# EAGLE design sm_watch (EAGLE 9.6.2)
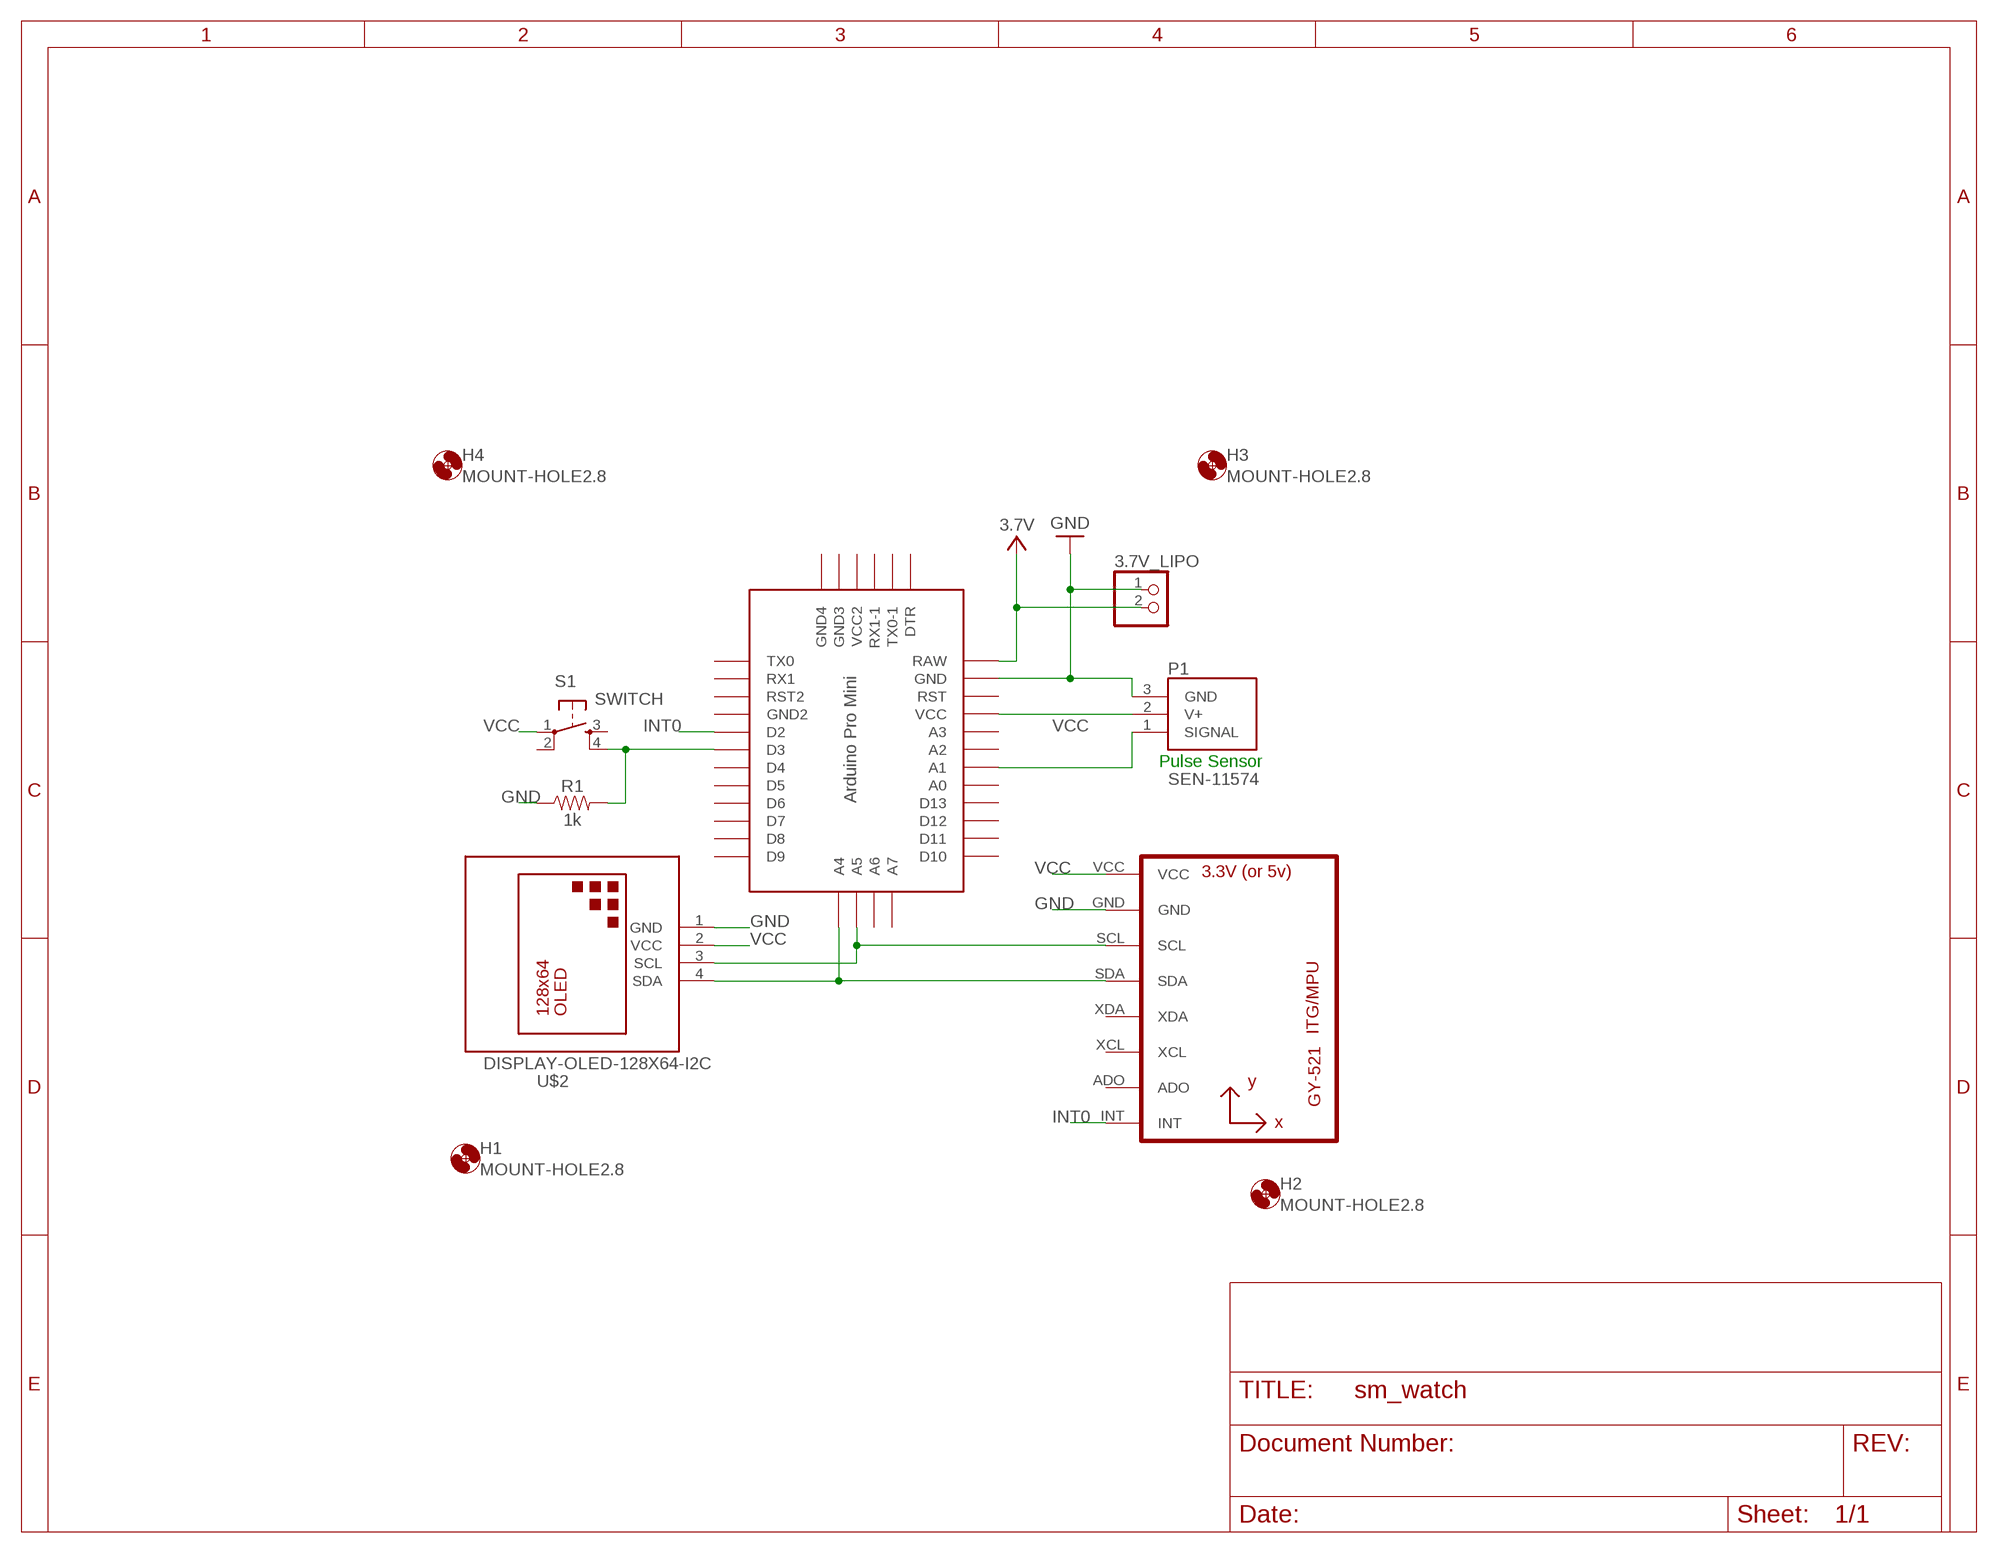
[diagram p0: schematic, sheet 1]

## Parts
3.7V_LIPO  PINHD-1X2/90  [1X02/90]
H1  MOUNT-HOLE2.8  [2,8]
H2  MOUNT-HOLE2.8  [2,8]
H3  MOUNT-HOLE2.8  [2,8]
H4  MOUNT-HOLE2.8  [2,8]
P1  SEN-11574  [XDCR_SEN-11574]
R1  1k  1KOHM-0402T-1/16W-1%  [0402-TIGHT]
S1  SWITCH  DTS-6  [DTS-6]
U1  GY-521MPU6050  [GY-521]
U$1  PRO-MINI  [PRO-MINI]
U$2  DISPLAY-OLED-128X64-I2C  [DISPLAY-OLED-128X64-I2C]

## Nets
+3V3: 3.7V_LIPO.2 U$1.RAW ; supply symbol labelled 3.7V
GND: 3.7V_LIPO.1 P1.3(GND) R1.1 U1.GND U$1.GND U$2.1(GND)
INT0: U1.INT U$1.D2
INT1: R1.2 S1.4 U$1.D3
N$1: U1.SDA U$1.A4 U$2.4(SDA)
N$2: U1.SCL U$1.A5 U$2.3(SCL)
N$4: P1.1(SIGNAL) U$1.A1
VCC: P1.2(V+) S1.1 U1.VCC U$1.VCC U$2.2(VCC)
Unconnected: S1.2 S1.3 U1.ADO U1.XCL U1.XDA U$1.A0 U$1.A2 U$1.A3 U$1.A6 U$1.A7 U$1.D4 U$1.D5 U$1.D6 U$1.D7 U$1.D8 U$1.D9 U$1.D10 U$1.D11 U$1.D12 U$1.D13 U$1.DTR U$1.GND1(GND2) U$1.GND2(GND4) U$1.GND3 U$1.RST U$1.RST1(RST2) U$1.RX1 U$1.RX1-1 U$1.TX0 U$1.TX0-1 U$1.VCC1(VCC2)

## Notes on the sheet
- Pulse Sensor

## Library data of the parts
3.7V_LIPO = pinhead:PINHD-1X2: PIN HEADER
H1-H4 = holes:MOUNT-HOLE: MOUNTING HOLE with drill center marker
P1 = SEN-11574:SEN-11574: Pulse Sensor For Arduino Buy Part <https://snapeda.com/parts/SEN-11574/SparkFun/view-part/?ref=eda>; AVAILABILITY: Bad; DESCRIPTION: PULSE SENSOR FOR ARDUINO; DIGIKEY-PURCHASE-URL: https://snapeda.com/shop?store=DigiKey&id=1269548; MF: SparkFun; MOUSER-PURCHASE-URL: https://snapeda.com/shop?store=Mouser&id=1269548; MP: SEN-11574; PACKAGE: None; PRICE: None
R1 = SparkFun-Resistors:1KOHM: 1kΩ resistor A resistor is a passive two-terminal electrical component that implements electrical resistance as a circuit element. Resistors act to reduce current flow, and, at the same time, act to lower voltage levels within circuits. - Wikipedia; PROD_ID: RES-14342
S1 = switch-tact:DTS-6
U1 = gy-521:GY-521
U$1 = Arduino-clone:PRO-MINI: Arduion Pro Mini Clone V1.0 www.betemcu.cu
U$2 = diy-modules:DISPLAY-OLED-128X64-I2C: 128x64 Dot Matrix OLED Module based on SSD1306 chip Variant with I2C interface More details available here: http://www.instructables.com/id/Monochrome-096-i2c-OLED-display-with-arduino-SSD13/ SSD1306 datasheet: https://cdn-shop.adafruit.com/datasheets/SSD1306.pdf Click here to find device on ebay.com <http://www.ebay.com/sch/oled+display+128x64+iic> Note: There are two variants: I2C and SPI. Search for the proper version.

## Board
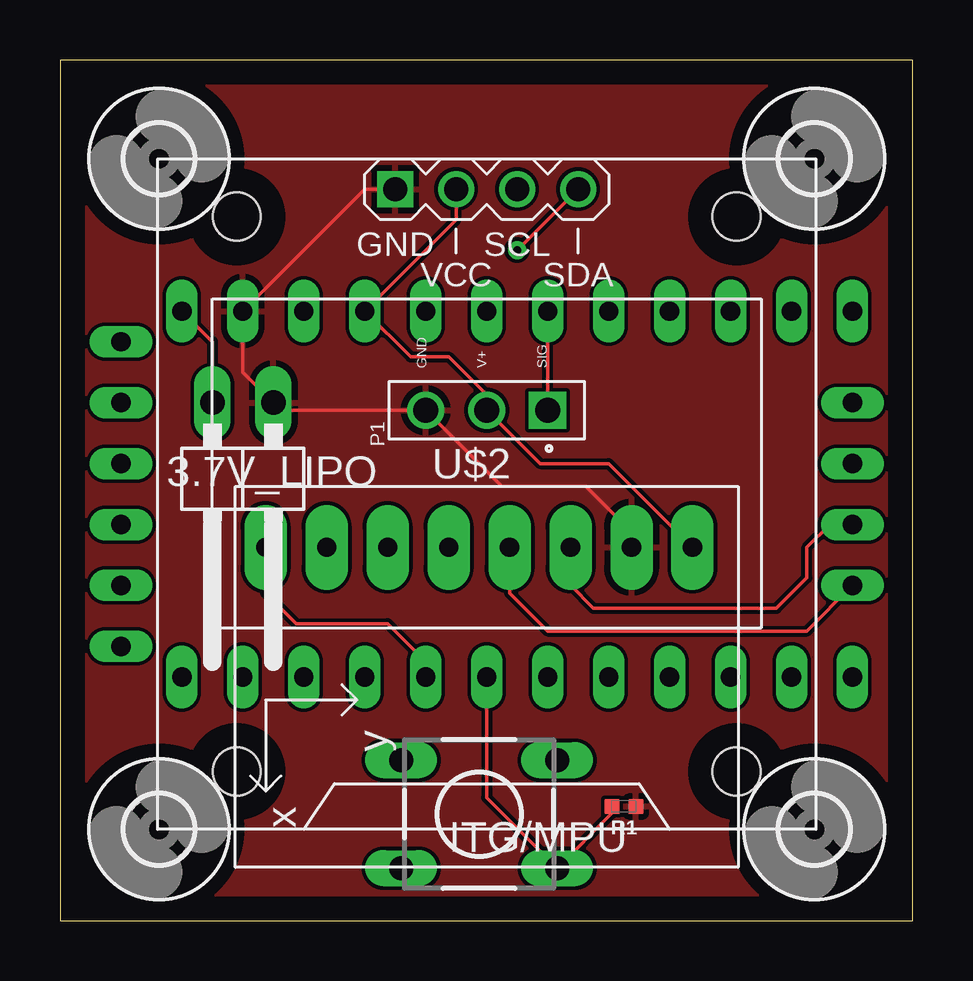
[diagram p1: board, top side]
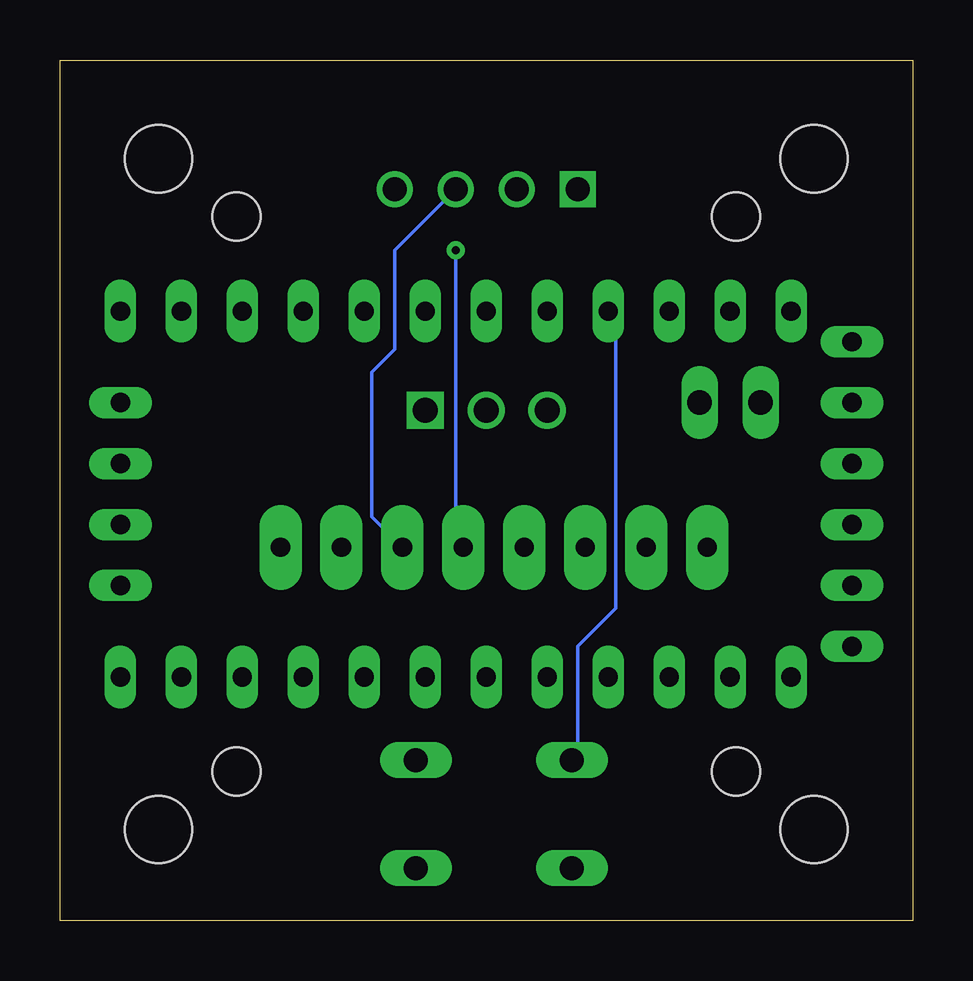
[diagram p2: board, bottom side, seen from below]

Size 35.54 x 35.87 mm. Coordinates in mm from the lower left corner, seen from the top.
Outline: 0,0 35.54,0 35.54,35.87 0,35.87 0,0
Copper layers (1*16): Top 0.035mm / dielectric 1.5mm / Bottom 0.035mm
Design rules "default": minimum track width 6mil, minimum drill 0.35mm, track to track 6mil, track to pad 6mil, pad to pad 6mil, via to via 6mil, smd to smd 6mil, copper to edge 40mil, drill to drill 6mil, minimum pad ring 10mil, minimum via ring 8mil, stop-mask expansion 4mil, vias tented up to drill 0mil, thermal gap 10mil

### Footprints (pad centres in the part's own frame; a part is rotated, then mirrored left to right if it is on the bottom)
1X02/90 = drill 1.016 long: 1 -1.27,-3.81; 2 1.27,-3.81
2,8 = hole 2.8: 0,0
XDCR_SEN-11574 = drill 1.04 square: 1 0,-2.54 | drill 1.04: 2 0,0; 3 0,2.54
0402-TIGHT = smd 0.6 x 0.6: 1 -0.5,0; 2 0.5,0
DTS-6 = drill 1 long: 1 -3.25,2.25; 2 3.25,2.25; 3 -3.25,-2.25; 4 3.25,-2.25
GY-521 = drill 0.8 pad 1.778 long: ADO -8.89,-6.35; GND -8.89,6.35; INT -8.89,-8.89; SCL -8.89,3.81; SDA -8.89,1.27; VCC -8.89,8.89; XCL -8.89,-3.81; XDA -8.89,-1.27
PRO-MINI = drill 0.8 long: A0 8.89,8.89; A1 8.89,11.43; A2 8.89,13.97; A3 8.89,16.51; A4 -2.54,-1.27; A5 0,-1.27; A6 2.54,-1.27; A7 5.08,-1.27; D2 -6.35,16.51; D3 -6.35,13.97; D4 -6.35,11.43; D5 -6.35,8.89; D6 -6.35,6.35; D7 -6.35,3.81; D8 -6.35,1.27; D9 -6.35,-1.27; D10 8.89,-1.27; D11 8.89,1.27; D12 8.89,3.81; D13 8.89,6.35; DTR 7.62,29.21; GND 8.89,24.13; GND1 -6.35,19.05; GND2 -5.08,29.21; GND3 -2.54,29.21; RAW 8.89,26.67; RST 8.89,21.59; RST1 -6.35,21.59; RX1 -6.35,24.13; RX1-1 2.54,29.21; TX0 -6.35,26.67; TX0-1 5.08,29.21; VCC 8.89,19.05; VCC1 0,29.21
DISPLAY-OLED-128X64-I2C = drill 1 square: 1 -3.81,12.7 | drill 1: 2 -1.27,12.7; 3 1.27,12.7; 4 3.81,12.7 | hole 2: -10.414,11.557; 10.414,11.557; 10.414,-11.557; -10.414,-11.557

### Placement (x,y rotation side)
3.7V_LIPO  7.62,17.78 180 top
H1  31.43,31.75 0 top
H2  4.13,3.81 0 top
H3  31.43,3.81 0 top
H4  4.13,31.75 0 top
P1  17.78,21.27 90 top
R1  23.5,4.76 180 top
S1  17.46,4.45 0 top
U1  17.46,6.67 270 top
U$1  31.75,16.51 90 top
U$2  17.78,17.78 0 top

### Tracks (layer width: path | path; a pad name or v marks a point on that pad's centre or on a via)
+3V3
  Top 0.152: U$1.RAW 6.35,24.13 3.7V_LIPO.2
GND
  Top 0.152: U$2.1 12.7,30.48 U$1.GND 7.62,22.86 3.7V_LIPO.1 9.21,21.27 P1.3 18.41,18.1 21.91,18.1 23.81,16.19 U1.GND
  pour Top: 0,0 0,35.88 35.56,35.88 35.56,0
INT0
  Top 0.152: U1.INT 8.57,13.65 9.84,12.38 13.65,12.38 15.24,10.79 U$1.D2
INT1
  Top 0.152: U$1.D3 17.78,5.13 S1.4 23,4.48 R1.2
N$1  (via drill 0.35)
  Top 0.152: U1.SDA 18.73,13.65 20.32,12.06 31.11,12.06 U$1.A4 | v19.05,27.94 U$2.4
  Bottom 0.152: v19.05,27.94 19.05,15.88 U1.SDA
N$2
  Top 0.152: U1.SCL 21.27,13.97 22.23,13.02 29.84,13.02 31.11,14.29 31.11,15.56 32.07,16.51 U$1.A5
  Bottom 0.152: U1.SCL 22.54,16.83 22.54,22.86 21.59,23.81 21.59,27.94 U$2.3
N$4
  Top 0.152: P1.1 U$1.A1
VCC
  Top 0.152: U$2.2 16.51,29.21 U$1.VCC 14.61,23.5 16.19,23.5 17.78,21.91 P1.2 20,19.05 22.86,19.05 U1.VCC
  Bottom 0.152: U$1.VCC 12.38,25.08 12.38,13.02 13.97,11.43 13.97,6.94 S1.1